# EAGLE design dcmctrl-hb-1-board_v1 (EAGLE 6.2)
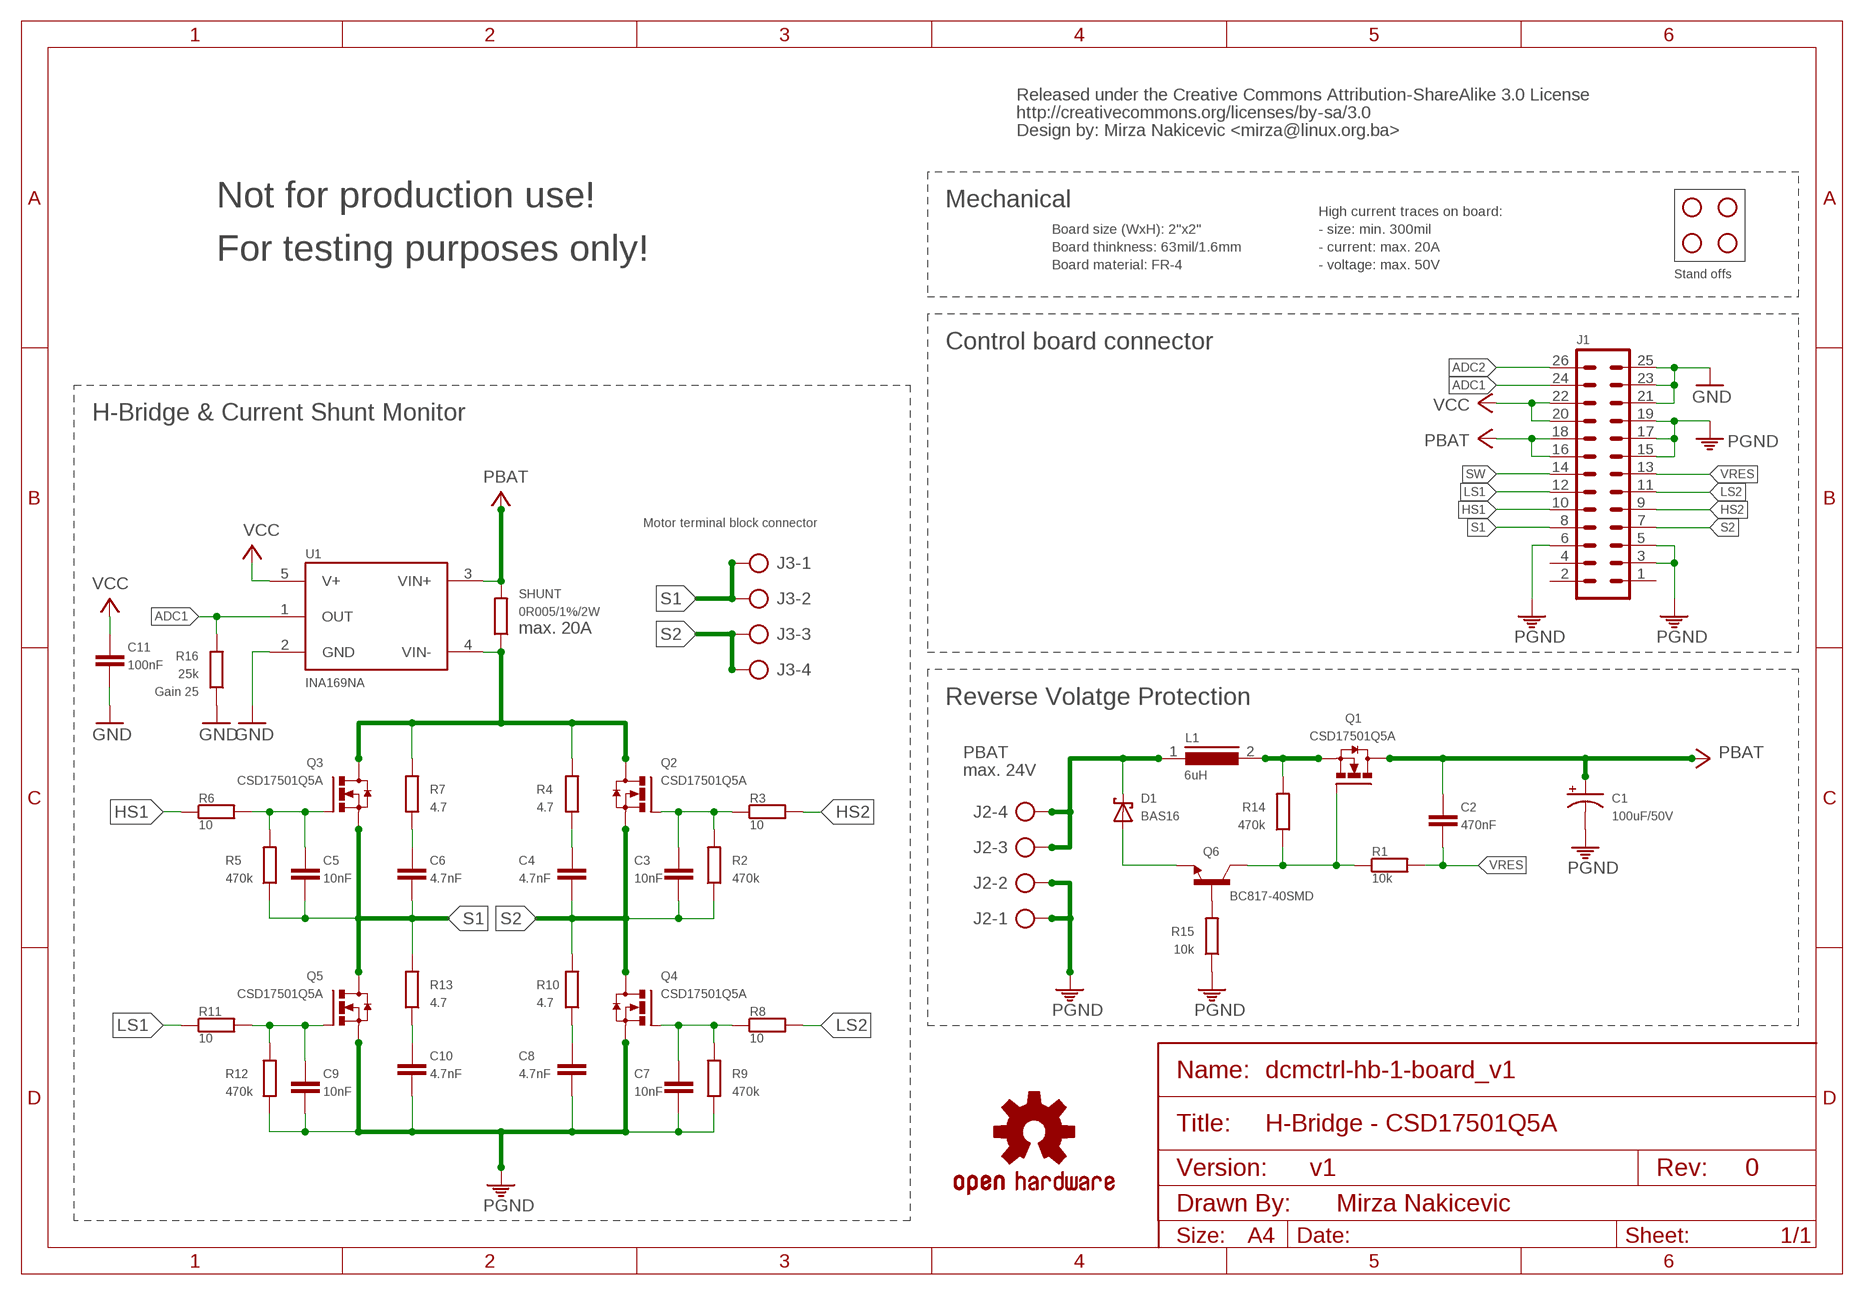
[diagram p0: schematic, sheet 1]

## Parts
C1  100uF/50V  CPOL-USE5-13  [E5-13]
C2  470nF  C-0603  [C0603]
C3  10nF  C-0603  [C0603]
C4  4.7nF  C-0603  [C0603]
C5  10nF  C-0603  [C0603]
C6  4.7nF  C-0603  [C0603]
C7  10nF  C-0603  [C0603]
C8  4.7nF  C-0603  [C0603]
C9  10nF  C-0603  [C0603]
C10  4.7nF  C-0603  [C0603]
C11  100nF  C-0603  [C0603]
D1  BAS16  BAS40  [SOT23]
J1  MA13-2  [MA13-2]
J2  W237-4  [W237-4]
J3  W237-4  [W237-4]
L1  6uH  DR127  [DR127]
Q1  CSD17501Q5A  [Q5A]
Q2  CSD17501Q5A  [Q5A]
Q3  CSD17501Q5A  [Q5A]
Q4  CSD17501Q5A  [Q5A]
Q5  CSD17501Q5A  [Q5A]
Q6  BC817-40SMD  [SOT23-BEC]
R1  10k  R-0603  [R0603]
R2  470k  R-0603  [R0603]
R3  10  R-0603  [R0603]
R4  4.7  R-0603  [R0603]
R5  470k  R-0603  [R0603]
R6  10  R-0603  [R0603]
R7  4.7  R-0603  [R0603]
R8  10  R-0603  [R0603]
R9  470k  R-0603  [R0603]
R10  4.7  R-0603  [R0603]
R11  10  R-0603  [R0603]
R12  470k  R-0603  [R0603]
R13  4.7  R-0603  [R0603]
R14  470k  R-0603  [R0603]
R15  10k  R-0603  [R0603]
R16  25k  R-0603  [R0603]
SHUNT  0R005/1%/2W  R-2512  [R2512]
U1  INA169NA  [SOT23-5]
U$2  STAND-OFF  [STAND-OFF]
U$3  STAND-OFF  [STAND-OFF]
U$4  STAND-OFF  [STAND-OFF]
U$6  STAND-OFF  [STAND-OFF]
U$9  CC-SA  [CC-SA]
U$10  OSHW-LOGOM  [OSHW-LOGO-M]

## Nets
ADC1: J1.24 R16.2 U1.1(OUT)
ADC2: J1.26
GND: C11.2 J1.21 J1.23 J1.25 R16.1 U1.2(GND)
HS1: J1.10 R6.1
HS2: J1.9 R3.2
LS1: J1.12 R11.1
LS2: J1.11 R8.2
N$1: C5.1 Q3.4(G) R5.2 R6.2
N$2: Q6.B R15.2
N$3: C9.1 Q5.4(G) R11.2 R12.2
N$4: C7.1 Q4.4(G) R8.1 R9.2
N$5: C3.1 Q2.4(G) R2.2 R3.1
N$6: C6.1 R7.1
N$7: D1.1(A) Q6.E
N$8: C10.1 R13.1
N$9: Q1.4(G) Q6.C R1.1 R14.1
N$10: C8.1 R10.1
N$11: C4.1 R4.1
PBAT: C1.+ C2.1 J1.16 J1.18 Q1.5(D) Q1.6(D) Q1.7(D) Q1.8(D) Q1.TP(D) SHUNT.2 U1.3(VIN+)
PBAT-: Q2.5(D) Q2.6(D) Q2.7(D) Q2.8(D) Q2.TP(D) Q3.5(D) Q3.6(D) Q3.7(D) Q3.8(D) Q3.TP(D) R4.2 R7.2 SHUNT.1 U1.4(VIN-)
PGND: C1.- C7.2 C8.2 C9.2 C10.2 J1.3 J1.5 J1.6 J1.15 J1.17 J1.19 J2.1 J2.2 Q4.1(S) Q4.2(S) Q4.3(S) Q5.1(S) Q5.2(S) Q5.3(S) R9.1 R12.1 R15.1
S1: C5.2 C6.2 J1.8 J3.1 J3.2 Q3.1(S) Q3.2(S) Q3.3(S) Q5.5(D) Q5.6(D) Q5.7(D) Q5.8(D) Q5.TP(D) R5.1 R13.2
S2: C3.2 C4.2 J1.7 J3.3 J3.4 Q2.1(S) Q2.2(S) Q2.3(S) Q4.5(D) Q4.6(D) Q4.7(D) Q4.8(D) Q4.TP(D) R2.1 R10.2
SW: J1.14
VCC: C11.1 J1.20 J1.22 U1.5(V+)
VIN: D1.3(C) J2.3 J2.4 L1.1
VIN2: L1.2 Q1.1(S) Q1.2(S) Q1.3(S) R14.2
VRES: C2.2 J1.13 R1.2
Unconnected: J1.1 J1.2 J1.4

## Notes on the sheet
- Not for production use! | Mechanical
- High current traces on board:
- Board size (WxH): 2"x2" | - size: min. 300mil
- Board thinkness: 63mil/1.6mm | - current: max. 20A
- For testing purposes only!
- Board material: FR-4 | - voltage: max. 50V
- Stand offs
- Control board connector
- H-Bridge & Current Shunt Monitor
- Motor terminal block connector
- max. 20A
- Gain 25
- Reverse Volatge Protection
- PBAT
- max. 24V
- H-Bridge - CSD17501Q5A
- v1 | 0
- Mirza Nakicevic
- A4

## Library data of the parts
C1 = rcl:CPOL-US: POLARIZED CAPACITOR, American symbol
C2-C11 = rlc:C: Capacitor Standard SMD ceramic and 0.1" leaded capacitors.
D1 = diode:BAS40: Silicon Schottky Diodes General-purpose diode for high-speed switching
J1 = con-pinhead:MA13-2: PIN HEADER; OC_FARNELL: unknown; OC_NEWARK: unknown
J2 J3 = con-wago-500:W237-4: WAGO SCREW CLAMP; OC_FARNELL: unknown; OC_NEWARK: unknown
L1 = inductors:DR127: High Power Density, High Efficiency, Shielded Inductors Source: coiltronics_dr_series.pdf
Q1-Q5 = transistor-fet:CSD17501
Q6 = transistor-npn:BC817*: NPN Transistor
R1-R16 SHUNT = rlc:R: Resistor Basic schematic elements and footprints for 0603, 1206, and PTH 1/10th watt (small) resistors.
U1 = ic-opamp:INA169: High-Side Measurement CURRENT SHUNT MONITOR
U$2-U$4 U$6 = other:STAND-OFF: Stand Off This is the mechanical footprint for a #4 phillips button head screw. Use the keepout ring to avoid running the screw head into surrounding components.
U$9 = other:CC-SA
U$10 = other:OSHW-LOGO: Open Source Hardware Logo This logo indicates the piece of hardware it is found on incorporates a OSHW license and/or adheres to the definition of open source hardware found here: http://freedomdefined.org/OSHW

## Board
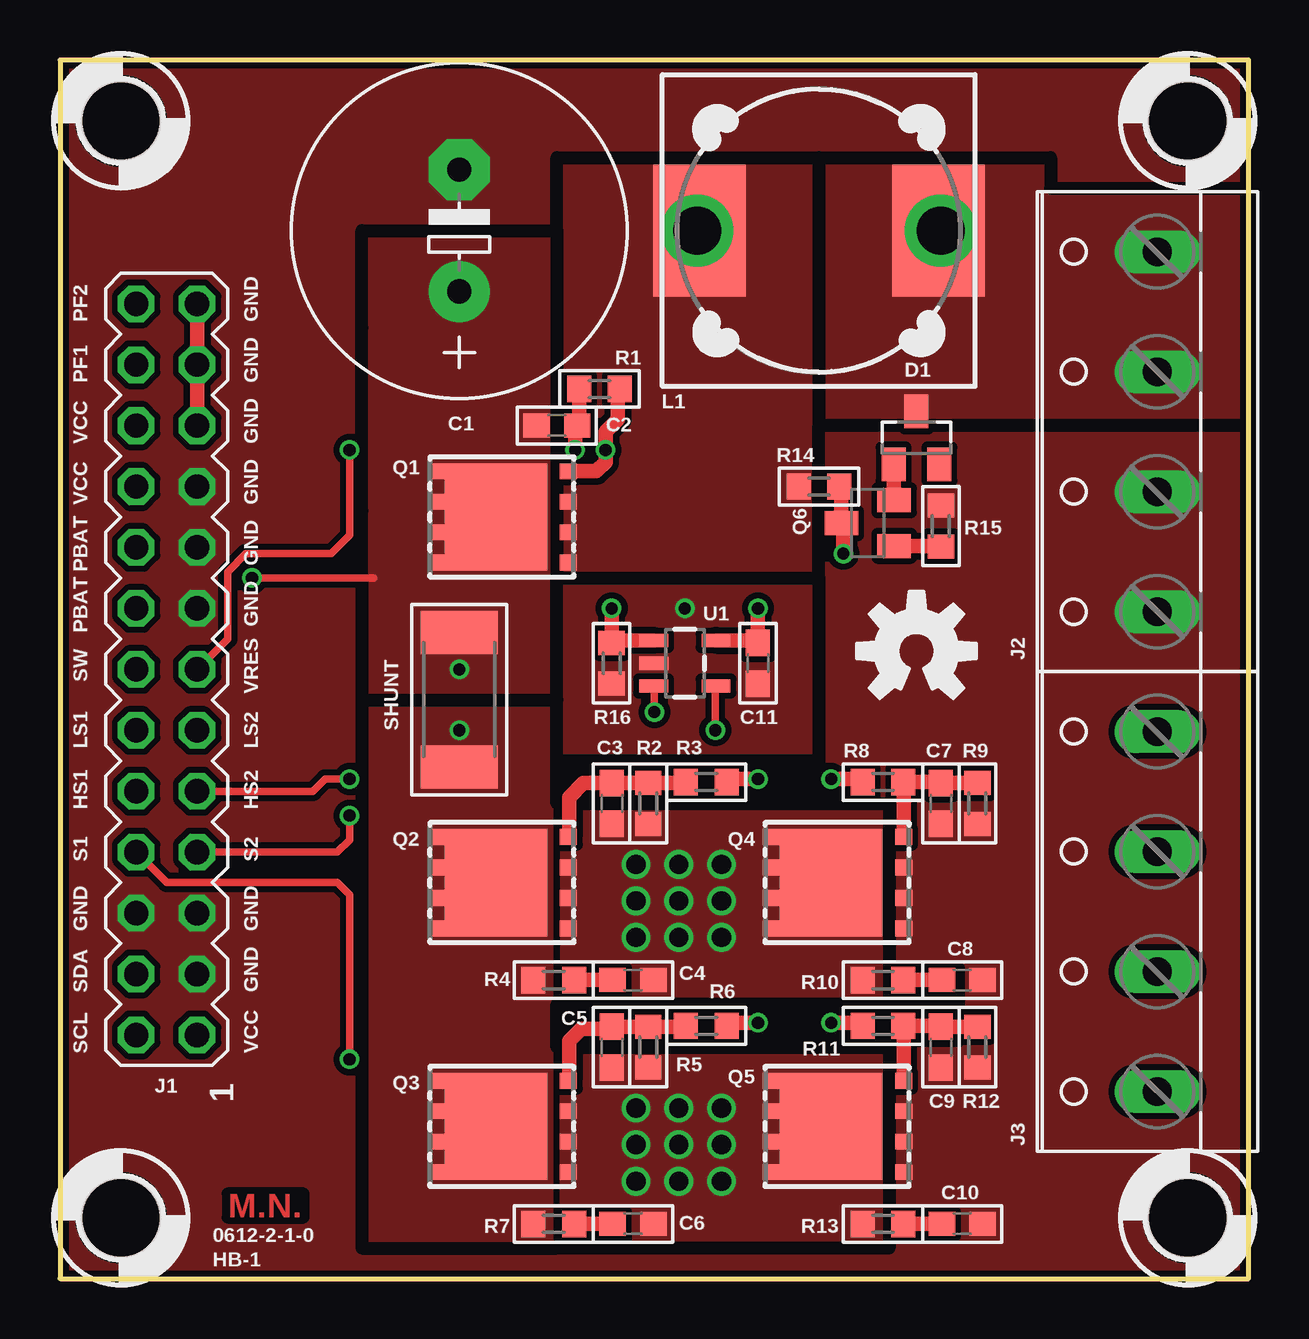
[diagram p1: board, top side]
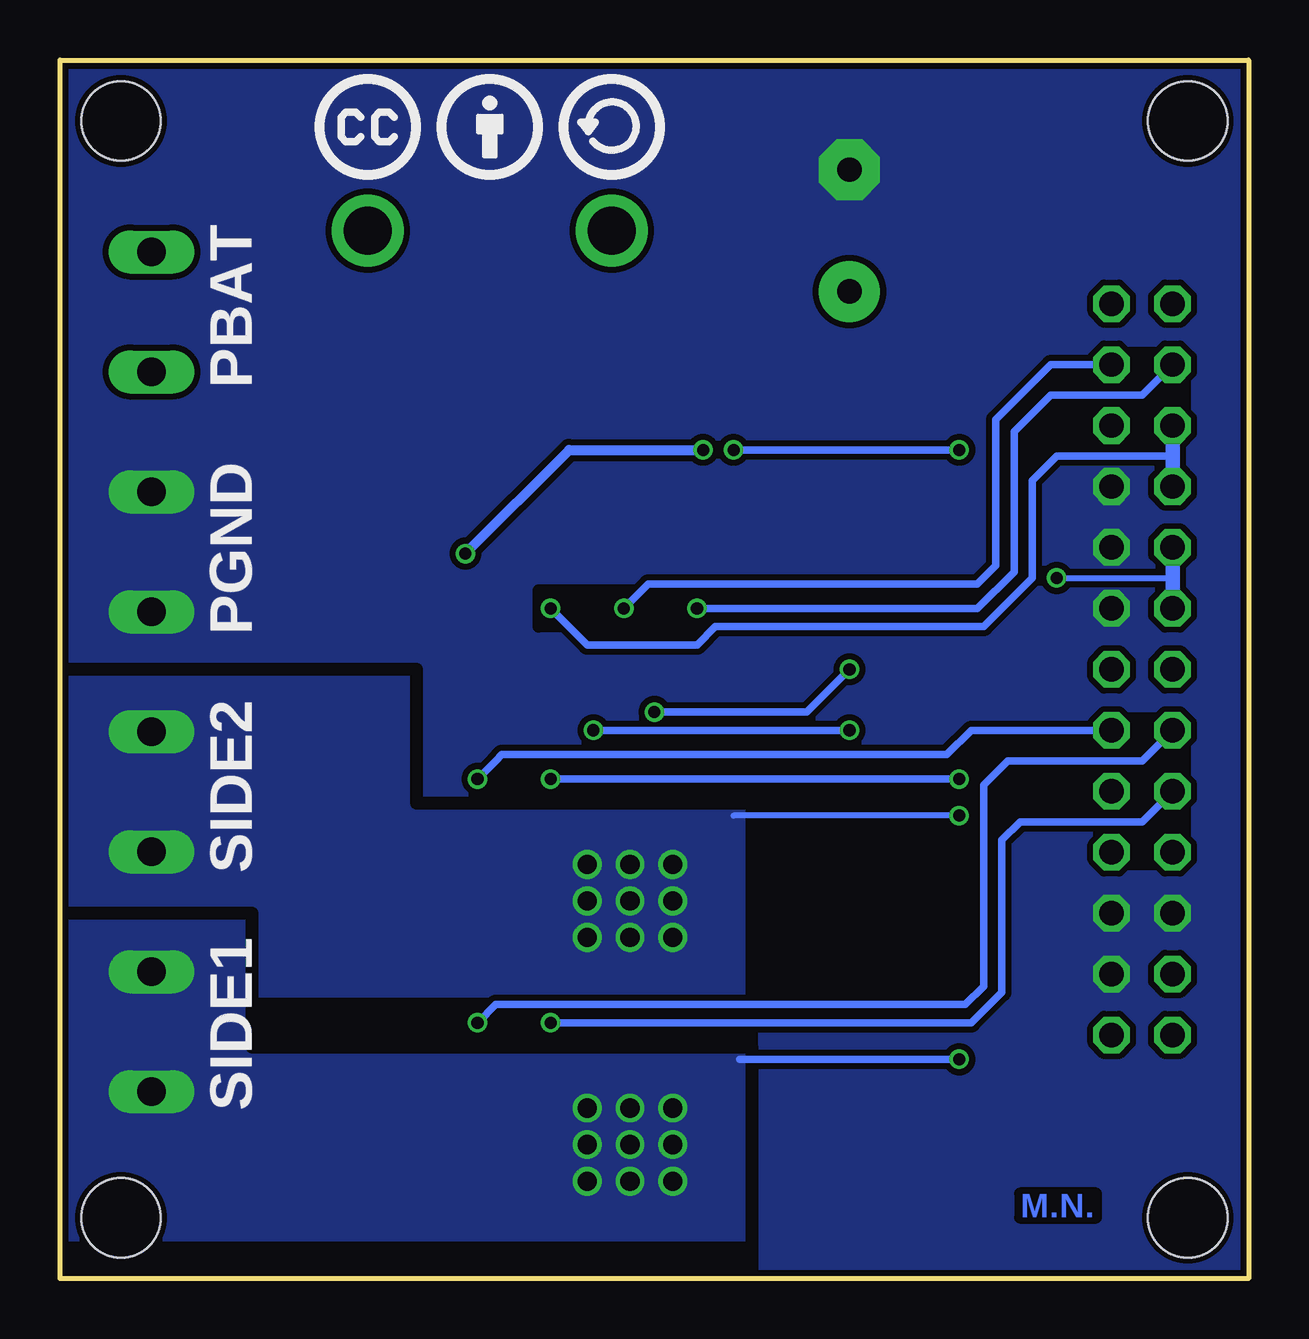
[diagram p2: board, bottom side, seen from below]

Size 49.53 x 50.8 mm. Coordinates in mm from the lower left corner, seen from the top.
Outline: 0,0 49.53,0 49.53,50.8 0,50.8 0,0
Copper layers (1*16): Top 0.035mm / dielectric 1.5mm / Bottom 0.035mm
Design rules: minimum track width 6mil, minimum drill 12mil, track to track 6mil, track to pad 6mil, pad to pad 6mil, via to via 6mil, smd to smd 0mil, copper to edge 10mil, drill to drill 10mil, minimum pad ring 10mil, minimum via ring 6mil, stop-mask expansion 2mil, vias tented up to drill 100mil, thermal gap 10mil
tRestrict: area 34.7,9.9 to 37.5,13; 37 lines
bRestrict: area 2.7,17.3 to 6.2,23.4; area 2.7,35.1 to 6.2,38.6; area 22.5,27.2 to 29.6,28.7; 16 lines

### Footprints (pad centres in the part's own frame; a part is rotated, then mirrored left to right if it is on the bottom)
E5-13 = drill 1.016 pad 2.54: + -2.54,0 | drill 1.016 pad 2.54 octagon: - 2.54,0
C0603 = smd 1.1 x 1: 1 -0.85,0; 2 0.85,0
SOT23 = smd 1 x 1.4: 1 -0.95,-1.1; 2 0.95,-1.1; 3 0,1.1
MA13-2 = drill 1.016 octagon: 1 -15.24,-1.27; 2 -15.24,1.27; 3 -12.7,-1.27; 4 -12.7,1.27; 5 -10.16,-1.27; 6 -10.16,1.27; 7 -7.62,-1.27; 8 -7.62,1.27; 9 -5.08,-1.27; 10 -5.08,1.27; 11 -2.54,-1.27; 12 -2.54,1.27; 13 0,-1.27; 14 0,1.27; 15 2.54,-1.27; 16 2.54,1.27; 17 5.08,-1.27; 18 5.08,1.27; 19 7.62,-1.27; 20 7.62,1.27; 21 10.16,-1.27; 22 10.16,1.27; 23 12.7,-1.27; 24 12.7,1.27; 25 15.24,-1.27; 26 15.24,1.27
W237-4 = drill 1.194 long: 1 -7.5,-1.27; 2 -2.5,-1.27; 3 2.5,-1.27; 4 7.5,-1.27
DR127 = smd 3.85 x 5.5: 1 -4.975,0; 2 4.975,0
Q5A = smd 0.711 x 0.66: 1 -2.769,1.905; 2 -2.769,0.635; 3 -2.769,-0.635; 4 -2.769,-1.905; 5 2.743,-1.905; 6 2.743,-0.635; 7 2.743,0.635; 8 2.743,1.905 | smd 4.267 x 4.47: TP 0.254,0
SOT23-BEC = smd 1 x 1.4: B -0.95,-1.1; C 0,1.1; E 0.95,-1.1
R0603 = smd 1 x 1.1: 1 -0.85,0; 2 0.85,0
R2512 = smd 1.8 x 3.2: 1 -2.8,0; 2 2.8,0
SOT23-5 = smd 0.55 x 1.2: 1 -0.95,-1.3; 2 0,-1.3; 3 0.95,-1.3; 4 0.95,1.3; 5 -0.95,1.3
STAND-OFF = hole 3.302: 0,0

### Placement (x,y rotation side)
C1  16.64,43.69 90 top
C2  20.7,35.56 0 top
C3  22.99,19.81 270 top
C4  23.88,12.45 0 top
C5  22.99,9.65 270 top
C6  23.88,2.29 0 top
C7  36.7,19.81 270 top
C8  37.59,12.45 0 top
C9  36.7,9.65 270 top
C10  37.59,2.29 0 top
C11  29.08,25.65 270 top
D1  35.69,35.05 0 top
J1  4.45,25.4 90 top
J2  44.45,35.3 90 top
J3  44.45,15.3 90 top
L1  31.62,43.69 180 top
Q1  18.41,31.75 180 top
Q2  18.41,16.51 180 top
Q3  18.41,6.35 180 top
Q4  32.38,16.51 180 top
Q5  32.38,6.35 180 top
Q6  33.66,31.5 90 top
R1  22.48,37.08 180 top
R2  24.51,19.81 90 top
R3  26.92,20.7 0 top
R4  20.57,12.45 180 top
R5  24.51,9.65 90 top
R6  26.92,10.54 180 top
R7  20.57,2.29 180 top
R8  34.29,20.7 180 top
R9  38.23,19.81 90 top
R10  34.29,12.45 180 top
R11  34.29,10.54 0 top
R12  38.23,9.65 90 top
R13  34.29,2.29 180 top
R14  31.62,33.02 180 top
R15  36.7,31.37 270 top
R16  22.99,25.65 90 top
SHUNT  16.64,24.13 90 top
U1  26.04,25.65 270 top
U$2  2.54,48.26 0 top
U$3  46.99,2.54 0 top
U$4  2.54,2.54 0 top
U$6  46.99,48.26 0 top
U$9  31.62,48.01 0 bottom
U$10  35.69,26.16 0 top

### Tracks (layer width: path | path; a pad name or v marks a point on that pad's centre or on a via)
ADC1  (via drill 0.51)
  Top 0.61: v22.99,27.94 R16.2 22.99,26.6 U1.1
  Bottom 0.305: J1.24 4.45,36.83 8.26,36.83 9.78,35.31 9.78,29.46 11.3,27.94 v22.99,27.94
GND  (via drill 0.51)
  Top 0.61: J1.25 J1.23 J1.21
  Bottom 0.305: v26.04,27.94 25.02,28.96 22.73,28.96 11.3,28.96 10.54,29.72 10.54,35.81 8.26,38.1 J1.23
  pour Top (isolate 0.254, no thermals): 20.95,28.96 31.37,28.96 31.37,21.84 20.95,21.84
HS1  (via drill 0.51)
  Top 0.254: 27.81,10.67 27.81,10.54 R6.1
  Top 0.61: v29.08,10.67 27.81,10.67
  Bottom 0.305: v29.08,10.67 12.32,10.67 11.56,10.67 10.29,11.94 10.29,18.29 9.53,19.05 4.45,19.05 J1.10
HS2  (via drill 0.51)
  Top 0.254: 27.81,20.83 27.81,20.7 R3.2
  Top 0.305: J1.9 10.54,20.32 11.05,20.83 v12.06,20.83
  Top 0.61: v29.08,20.83 27.81,20.83
  Bottom 0.305: v12.06,20.83 v29.08,20.83
LS1  (via drill 0.51)
  Top 0.254: 33.4,10.67 R11.1
  Top 0.61: v32.13,10.67 33.4,10.67
  Bottom 0.305: v32.13,10.67 31.37,11.43 28.57,11.43 13.08,11.43 11.81,11.43 11.05,12.19 11.05,20.57 10.03,21.59 4.45,21.59 J1.12
LS2  (via drill 0.51)
  Top 0.254: 33.4,20.83 R8.2
  Top 0.61: v32.13,20.83 33.4,20.83
  Bottom 0.305: v32.13,20.83 31.37,21.59 31.11,21.84 28.83,21.84 12.57,21.84 11.56,22.86 J1.11
N$1
  Top 0.305: 21.21,8.28 Q3.4
  Top 0.61: 26.04,10.41 R6.2 26.04,10.5 R5.2 C5.1 22.99,10.41 21.72,10.41 21.21,9.91 21.21,8.28
N$2
  Top 0.61: Q6.B 36.68,30.55 R15.2
N$3
  Top 0.61: R12.2 C9.1 36.66,10.54 R11.2 35.15,10.53 Q5.4
N$4
  Top 0.61: 36.7,20.57 C7.1 | C7.1 R9.2 | Q4.4 35.15,20.69 R8.1 36.66,20.7 C7.1
N$5
  Top 0.305: 21.21,18.44 Q2.4
  Top 0.61: 26.04,20.57 R3.1 26.04,20.66 R2.2 C3.1 21.8,20.66 21.21,20.07 21.21,18.44
N$6
  Top 0.61: R7.1 C6.1
N$7
  Top 0.61: D1.1 34.74,32.46 Q6.E
N$8
  Top 0.61: R13.1 C10.1
N$9  (via drill 0.51)
  Top 0.254: 23.5,37.08 R1.1
  Top 0.305: 23.24,37 R1.1
  Top 0.61: Q1.4 22.35,33.66 22.73,34.04 v22.73,34.54 22.73,35.31 23.24,35.81 23.24,37 | v32.64,30.23 32.64,31.41 Q6.C 32.55,32.94 R14.1
  Bottom 0.406: v32.64,30.23 28.32,34.54 v22.73,34.54
N$10
  Top 0.61: R10.1 C8.1
N$11
  Top 0.61: R4.1 C4.1
PBAT  (via drill 0.51)
  Top 0.305: v8,29.21 13.08,29.21 | U1.3 24.77,24.7 v24.77,23.62
  Bottom 0.254: v8,29.21 3.17,29.21
  Bottom 0.305: v16.64,25.4 18.41,23.62 v24.77,23.62
  Bottom 0.61: J1.16 3.17,29.21 J1.18
  pour Top (isolate 0.254, no thermals): 12.83,24.38 20.45,24.38 20.45,43.43 12.83,43.43
PBAT-  (via drill 0.51)
  Top 0.305: U1.4 27.3,24.7 v27.3,22.86
  Bottom 0.305: v16.64,22.86 v27.3,22.86
  pour Top (isolate 0.254, no thermals): 12.83,1.52 20.45,1.52 20.45,23.88 12.83,23.88
PGND
  pour Top (isolate 0.254, no thermals): 0,0 49.53,0 49.53,50.8 0,50.8
  pour Bottom (isolate 0.254, no thermals): 0,0 49.53,0 49.53,50.8 0,50.8
S1  (via drill 0.51, 0.8)
  Top 0.305: J1.8 4.45,16.51 11.56,16.51 12.06,16 v12.06,9.14
  Bottom 0.305: v12.06,9.14 21.21,9.14
  other vias: 27.56,5.59 25.78,5.59 24,5.59 24,7.11 25.78,7.11 27.56,7.11 24,4.06 25.78,4.06 27.56,4.06
  pour Top (isolate 0.254, no thermals): 20.95,9.4 34.42,9.4 34.42,1.52 20.95,1.52
  pour Bottom (isolate 0.254, no thermals): 20.95,1.52 49.15,1.52 49.15,14.99 41.78,14.99 41.78,9.4 20.95,9.4
S2  (via drill 0.51, 0.8)
  Top 0.305: J1.7 11.56,17.78 12.06,18.29 v12.06,19.3
  Bottom 0.254: v12.06,19.3 21.46,19.3
  other vias: 25.78,15.75 27.56,15.75 27.56,17.27 25.78,17.27 24,17.27 24,15.75 24,14.22 25.78,14.22 27.56,14.22
  pour Top (isolate 0.254, no thermals): 20.95,11.68 34.42,11.68 34.42,19.56 20.95,19.56
  pour Bottom (isolate 0.254, no thermals): 20.95,11.68 41.27,11.68 41.27,15.49 49.15,15.49 49.15,25.15 34.92,25.15 34.92,19.56 20.95,19.56
VCC  (via drill 0.51)
  Top 0.61: v29.08,27.94 C11.1 29.08,26.6 U1.5
  Bottom 0.305: 3.17,34.29 4.45,34.29 8,34.29 9.02,33.27 9.02,29.21 11.05,27.18 22.23,27.18 22.99,26.42 27.56,26.42 v29.08,27.94
  Bottom 0.61: J1.20 3.17,34.29 J1.22
VIN  (via drill 2)
  other vias: 36.7,43.69
  pour Top (isolate 0.254, no thermals): 31.88,46.48 49.15,46.48 49.4,35.81 31.88,35.81
VIN2  (via drill 2)
  other vias: 26.54,43.69
  pour Top (isolate 0.254, no thermals): 20.95,29.46 31.37,29.46 31.37,46.48 20.95,46.48
VRES  (via drill 0.51)
  Top 0.305: J1.13 6.99,26.67 6.99,29.46 7.75,30.23 11.3,30.23 12.06,30.99 v12.06,34.54 | 21.46,35.47 C2.2 21.63,35.64
  Top 0.61: v21.46,34.54 21.46,35.47 | R1.2 21.63,35.64
  Bottom 0.305: v12.06,34.54 v21.46,34.54

### Text on the board
Top: M.N.
Bottom: M.N.
tPlace: PF2 | GND | PF1 | GND | VCC | GND | VCC | GND | GND | PBAT | PBAT | GND | SW | VRES | LS1 | LS2 | HS1 | HS2 | S1 | S2 | GND | GND | SDA | GND | SCL | VCC | 1 | 0612-2-1-0 | HB-1
bPlace: PBAT | PGND | SIDE2 | SIDE1